# EAGLE design TS2068-CARTRIDGE-READER-2012 (EAGLE 5.10)
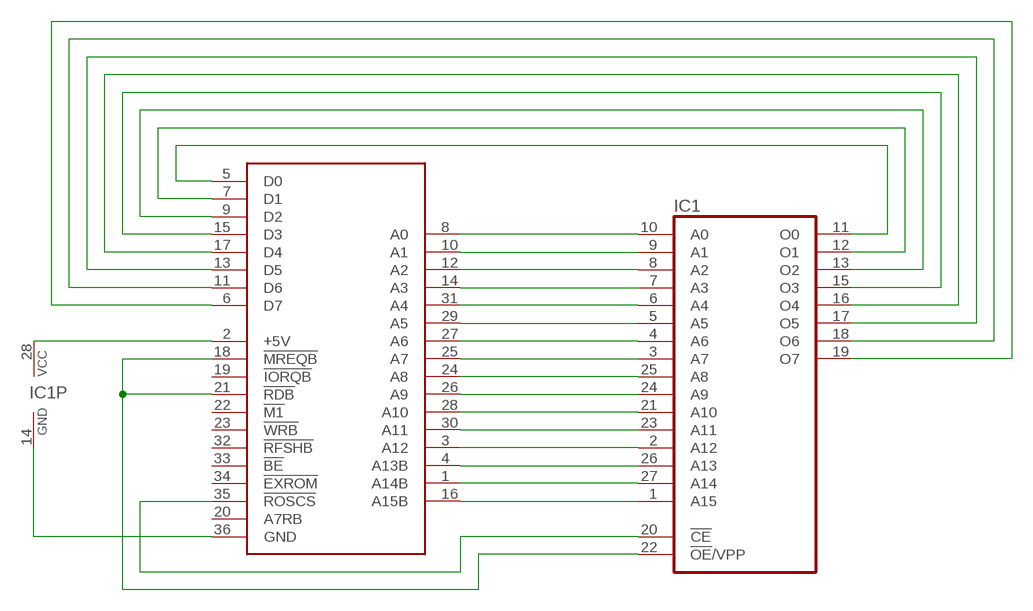
[diagram p0: schematic, sheet 1]

## Parts
IC1  27C512D-MINIMAL-OUTLINE  [DIL28-6-MINIMAL-OUTLINE]
TS1  TS2068-CARTRIDGE-HEADER+SLOT  [TS2068-CARTRIDGE-HEADER+SLOT]

## Nets
GND [power]: IC1.14(GND) TS1.36(GND)
N$1: IC1.10(A0) TS1.8(A0)
N$2: IC1.9(A1) TS1.10(A1)
N$3: IC1.8(A2) TS1.12(A2)
N$4: IC1.7(A3) TS1.14(A3)
N$5: IC1.6(A4) TS1.31(A4)
N$6: IC1.5(A5) TS1.29(A5)
N$7: IC1.4(A6) TS1.27(A6)
N$8: IC1.3(A7) TS1.25(A7)
N$9: IC1.25(A8) TS1.24(A8)
N$10: IC1.24(A9) TS1.26(A9)
N$11: IC1.21(A10) TS1.28(A10)
N$12: IC1.23(A11) TS1.30(A11)
N$13: IC1.2(A12) TS1.3(A12)
N$14: IC1.26(A13) TS1.4(A13B)
N$15: IC1.27(A14) TS1.1(A14B)
N$16: IC1.1(A15) TS1.16(A15B)
N$17: IC1.20(!CE) TS1.35(!ROSCS)
N$18: IC1.11(O0) TS1.5(D0)
N$19: IC1.12(O1) TS1.7(D1)
N$20: IC1.13(O2) TS1.9(D2)
N$21: IC1.15(O3) TS1.15(D3)
N$22: IC1.16(O4) TS1.17(D4)
N$23: IC1.17(O5) TS1.13(D5)
N$24: IC1.18(O6) TS1.11(D6)
N$25: IC1.19(O7) TS1.6(D7)
N$26 [power]: IC1.28(VCC) TS1.2(+5V)
N$28: IC1.22(!OE!/VPP) TS1.18(!MREQB) TS1.21(!RDB)
Unconnected: TS1.19(!IORQB) TS1.20(A7RB) TS1.22(!M1) TS1.23(!WRB) TS1.32(!RFSHB) TS1.33(!BE) TS1.34(!EXROM)

## Library data of the parts
IC1 = GIMEchip-EPROM:27C512D: MEMORY
TS1 = GIMEchip-TS2068-ROM-Cartridge:TS2068-CARTRIDGE

## Net classes
0 default: width 0.254 mm, clearance 0.203 mm
1 power: width 0.762 mm, clearance 0.203 mm

## Board
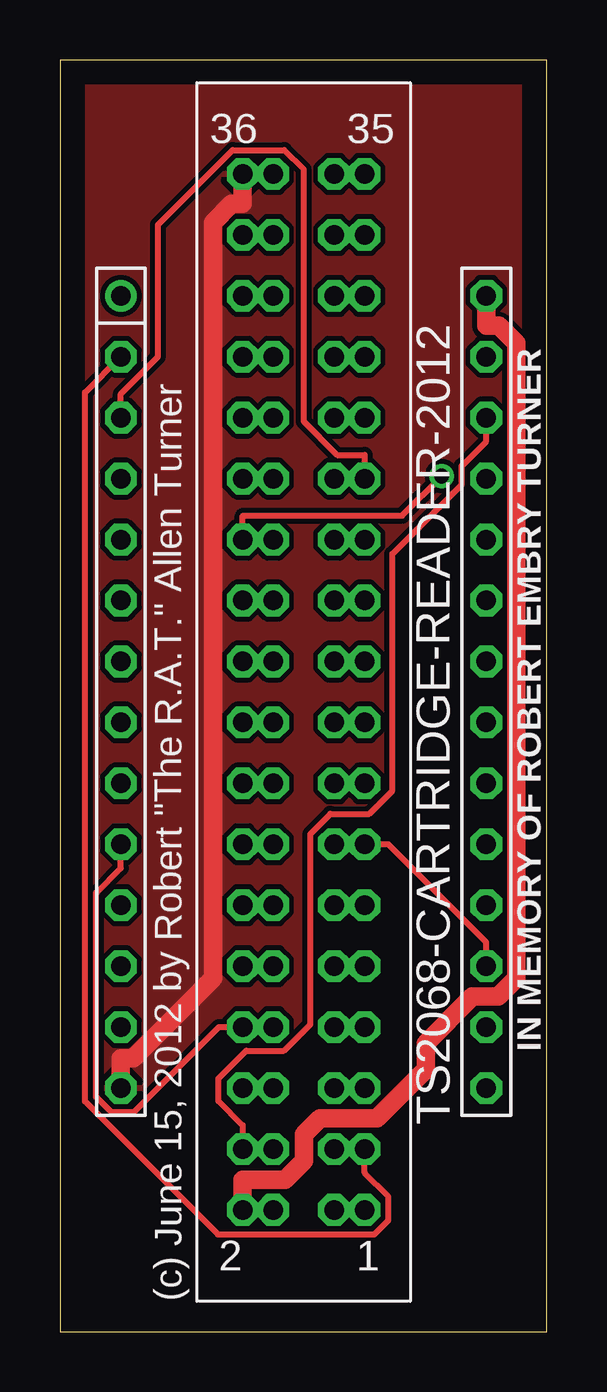
[diagram p1: board, top side]
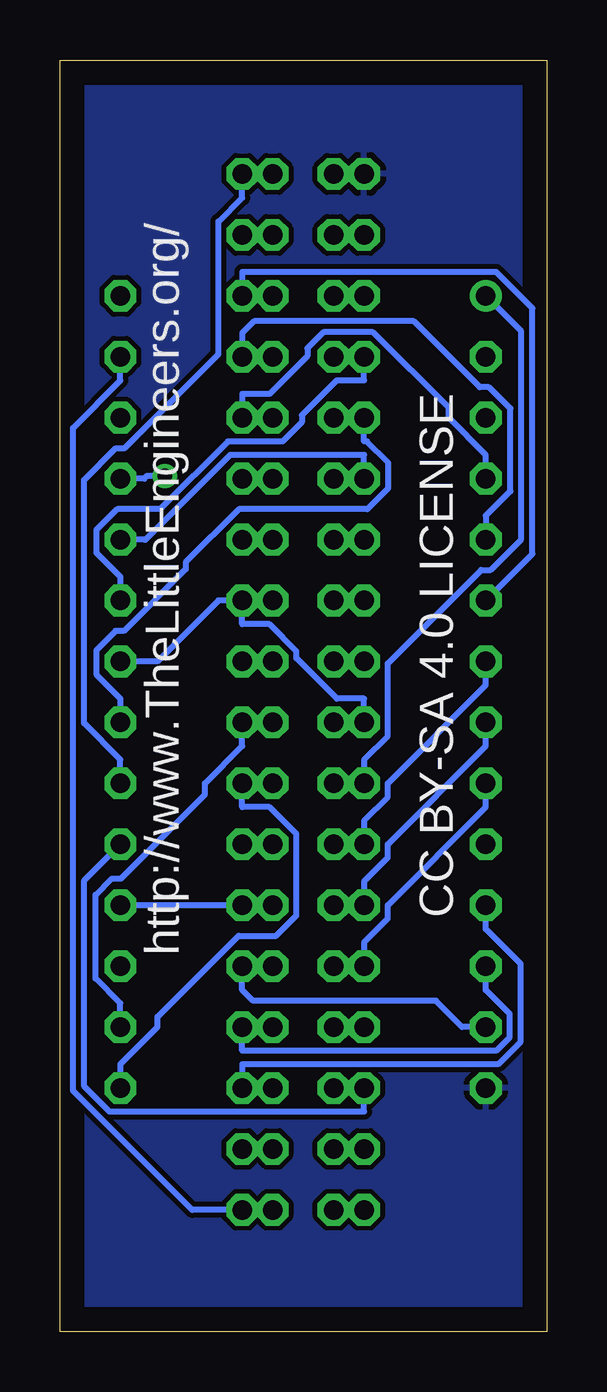
[diagram p2: board, bottom side, seen from below]

Size 20.3 x 53.01 mm. Coordinates in mm from the lower left corner, seen from the top.
Outline: 0,0 20.3,0 20.3,53.01 0,53.01 0,0
Copper layers (1*16): Top 0.035mm / dielectric 1.5mm / Bottom 0.035mm
Design rules "default": minimum track width 10mil, minimum drill 24mil, track to track 8mil, track to pad 8mil, pad to pad 8mil, via to via 8mil, smd to smd 8mil, copper to edge 40mil, drill to drill 8mil, minimum pad ring 10mil, minimum via ring 8mil, stop-mask expansion 4mil, vias tented up to drill 0mil, thermal gap 10mil

### Footprints (pad centres in the part's own frame; a part is rotated, then mirrored left to right if it is on the bottom)
DIL28-6-MINIMAL-OUTLINE = drill 0.813 round: 1 -16.51,-7.62 | drill 0.813 octagon: 2 -13.97,-7.62; 3 -11.43,-7.62; 4 -8.89,-7.62; 5 -6.35,-7.62; 6 -3.81,-7.62; 7 -1.27,-7.62; 8 1.27,-7.62; 9 3.81,-7.62; 10 6.35,-7.62; 11 8.89,-7.62; 12 11.43,-7.62; 13 13.97,-7.62; 14 16.51,-7.62; 15 16.51,7.62; 16 13.97,7.62; 17 11.43,7.62; 18 8.89,7.62; 19 6.35,7.62; 20 3.81,7.62; 21 1.27,7.62; 22 -1.27,7.62; 23 -3.81,7.62; 24 -6.35,7.62; 25 -8.89,7.62; 26 -11.43,7.62; 27 -13.97,7.62; 28 -16.51,7.62
TS2068-CARTRIDGE-HEADER+SLOT = drill 0.813 octagon: 1 2.54,-21.59; 2 -2.54,-21.59; 3 2.54,-19.05; 4 -2.54,-19.05; 5 2.54,-16.51; 6 -2.54,-16.51; 7 2.54,-13.97; 8 -2.54,-13.97; 9 2.54,-11.43; 10 -2.54,-11.43; 11 2.54,-8.89; 12 -2.54,-8.89; 13 2.54,-6.35; 14 -2.54,-6.35; 15 2.54,-3.81; 16 -2.54,-3.81; 17 2.54,-1.27; 18 -2.54,-1.27; 19 2.54,1.27; 20 -2.54,1.27; 21 2.54,3.81; 22 -2.54,3.81; 23 2.54,6.35; 24 -2.54,6.35; 25 2.54,8.89; 26 -2.54,8.89; 27 2.54,11.43; 28 -2.54,11.43; 29 2.54,13.97; 30 -2.54,13.97; 31 2.54,16.51; 32 -2.54,16.51; 33 2.54,19.05; 34 -2.54,19.05; 35 2.54,21.59; 36 -2.54,21.59; 41 1.27,-21.59; 42 -1.27,-21.59; 43 1.27,-19.05; 44 -1.27,-19.05; 45 1.27,-16.51; 46 -1.27,-16.51; 47 1.27,-13.97; 48 -1.27,-13.97; 49 1.27,-11.43; 50 -1.27,-11.43; 51 1.27,-8.89; 52 -1.27,-8.89; 53 1.27,-6.35; 54 -1.27,-6.35; 55 1.27,-3.81; 56 -1.27,-3.81; 57 1.27,-1.27; 58 -1.27,-1.27; 59 1.27,1.27; 60 -1.27,1.27; 61 1.27,3.81; 62 -1.27,3.81; 63 1.27,6.35; 64 -1.27,6.35; 65 1.27,8.89; 66 -1.27,8.89; 67 1.27,11.43; 68 -1.27,11.43; 69 1.27,13.97; 70 -1.27,13.97; 71 1.27,16.51; 72 -1.27,16.51; 73 1.27,19.05; 74 -1.27,19.05; 75 1.27,21.59; 76 -1.27,21.59

### Placement (x,y rotation side)
IC1  10.16,26.67 270 top
TS1  10.16,26.67 0 top

### Tracks (layer width: path | path; a pad name or v marks a point on that pad's centre or on a via)
GND
  Top 0.762: IC1.14 2.54,11.4 3.06,11.4 6.38,14.72 6.38,46.24 7.15,47.02 7.62,47.02 TS1.36
  pour Bottom: 0,53.34 20.32,53.34 20.32,0 0,0
  pour Top: 0,53.34 20.32,53.34 20.32,0 0,0
N$1
  Top 0.254: IC1.10 2.54,19.33 1.51,18.3 1.51,9.79 2.13,9.16 3.09,9.16 6.63,12.7 TS1.8
N$2
  Bottom 0.254: IC1.9 2.54,21.87 6.63,17.78 6.63,17.22 7.62,16.23 TS1.10
N$3
  Bottom 0.254: IC1.8 2.54,24.41 6.63,20.32 6.63,19.76 7.62,18.77 TS1.12
N$4
  Bottom 0.254: IC1.7 2.54,26.95 6.63,22.86 6.63,22.3 7.62,21.31 TS1.14
N$5
  Bottom 0.254: TS1.31 12.7,44.17 2.11,44.17 0.6,42.66 0.6,32.42 IC1.6
N$6
  Bottom 0.254: IC1.5 2.54,34.01 1.52,35.03 1.52,38.48 2.4,39.37 2.79,39.37 5.54,42.12 12.21,42.12 12.7,41.63 TS1.29
N$7
  Bottom 0.254: IC1.4 2.54,36.55 4.09,38.1 4.09,38.51 7.24,41.66 9.31,41.66 9.98,40.99 9.98,40.67 11.56,39.09 12.7,39.09 TS1.27
N$8
  Top 0.254: IC1.3 2.54,39.09 4.09,40.64 4.09,46.14 7.21,49.26 9.35,49.26 10.16,48.45 10.16,37.95 11.56,36.55 12.7,36.55 TS1.25
N$9  (via drill 0.61 pad 1.02)
  Top 0.254: TS1.24 7.62,34.01 14.26,34.01 v15.92,35.67
  Bottom 0.254: IC1.25 16.79,35.56 16.68,35.67 v15.92,35.67
N$10
  Bottom 0.254: IC1.24 16.79,33.02 16.74,33.02 13.21,36.55 7.62,36.55 TS1.26
N$11
  Bottom 0.254: IC1.21 17.78,26.39 18.79,27.4 18.79,28.41 17.98,29.21 17.62,29.21 15.05,31.78 15.05,32.07 12.84,34.29 7.48,34.29 6.61,35.17 6.61,36.22 7.5,37.11 7.62,37.11 TS1.28
N$12
  Bottom 0.254: IC1.23 17.78,31.47 18.78,32.47 18.78,33.42 17.91,34.29 16.11,34.29 13.29,37.11 11.02,37.11 10.21,37.91 10.21,38.2 8.76,39.65 7.62,39.65 TS1.30
N$13
  Top 0.254: TS1.3 12.7,6.63 13.69,5.64 13.69,4.64 13.11,4.06 6.59,4.06 1.05,9.6 1.05,39.15 IC1.2
N$14
  Top 0.254: 13.85,32.42 13.85,22.55 12.9,21.59 11.28,21.59 10.44,20.75 10.44,12.81 9.34,11.71 7.76,11.71 6.61,10.55 6.61,9.62 7.62,8.61 TS1.4 | 13.85,32.42 | 13.85,32.42 16.76,35.32 16.76,36.09 17.78,37.11 IC1.26
N$15
  Bottom 0.254: TS1.1 14.79,5.08 19.75,10.05 19.75,37.67 17.78,39.65 IC1.27
N$16
  Bottom 0.254: IC1.1 1.06,41.7 1.06,33.02 2.33,31.75 2.73,31.75 6.63,27.86 6.63,24.84 7.62,23.85 TS1.16
N$17
  Bottom 0.254: IC1.20 17.78,23.85 19.3,25.37 19.3,35.5 17.97,36.83 17.6,36.83 13.69,40.74 13.69,46.28 12.7,47.27 TS1.35
N$18
  Bottom 0.254: IC1.11 2.54,16.79 1.09,15.34 1.09,12.09 2.02,11.15 12.7,11.15 TS1.5
N$19
  Bottom 0.254: IC1.12 2.54,14.25 1.54,13.25 1.54,12.28 2.11,11.71 12.7,11.71 TS1.7
N$20
  Bottom 0.254: IC1.13 3.53,12.7 4.62,13.79 12.24,13.79 12.7,14.25 TS1.9
N$21
  Bottom 0.254: IC1.15 17.78,11.15 16.23,12.7 16.23,13.13 12.85,16.51 11.28,16.51 10.44,17.35 10.44,20.75 11.56,21.87 12.7,21.87 TS1.15
N$22
  Bottom 0.254: TS1.17 12.7,24.41 14.25,22.86 14.25,22.39 17.75,18.89 18.14,18.89 18.82,18.21 18.82,14.73 17.78,13.69 IC1.16
N$23
  Top 0.254: IC1.17 17.78,16.23 13.69,20.32 TS1.13
N$24
  Bottom 0.254: TS1.11 IC1.18
N$25
  Bottom 0.254: TS1.6 7.62,9.17 18.23,9.17 19.29,10.22 19.29,18.82 IC1.19
N$26
  Top 0.762: IC1.28 17.78,41.94 18.3,41.94 19.02,41.21 19.02,14.72 18.27,13.97 17.21,13.97 15.27,12.03 15.27,10.94 13.22,8.89 10.85,8.89 10.19,8.22 10.19,7.12 9.39,6.33 7.62,6.33 TS1.2
N$28
  Bottom 0.254: TS1.18 7.62,26.39 8.75,26.39 10.44,28.08 10.44,28.36 11.56,29.49 12.7,29.49 TS1.21 13.69,30.48 16.23,27.94 IC1.22

### Text on the board
tPlace: IN MEMORY OF ROBERT EMBRY TURNER | TS2068-CARTRIDGE-READER-2012 | (c) June 15, 2012 by Robert "The R.A.T." Allen Turner
bPlace: http://www.TheLittleEngineers.org/ | CC BY-SA 4.0 LICENSE